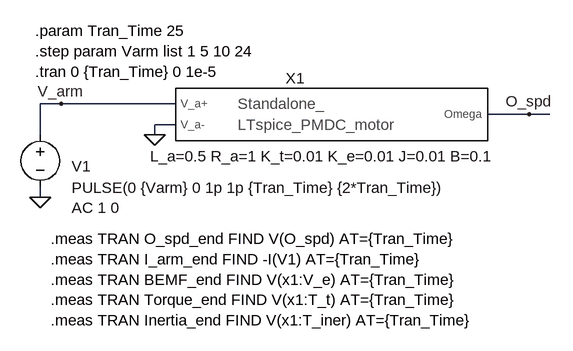
[diagram p0: schematic Jig_Standalone_LTspice_PMDC_motor.asc]
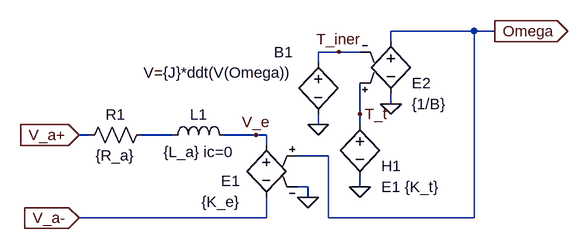
[diagram p1: sub-circuit standalone_ltspice_pmdc_motor.asc]
Jig_Standalone_LTspice_PMDC_motor.asc, the LTspice schematic file:
Version 4.1
SHEET 1 908 680
WIRE -64 64 -96 64
WIRE 112 64 -64 64
WIRE 656 80 592 80
WIRE 688 80 656 80
WIRE 112 96 80 96
WIRE -96 112 -96 64
WIRE 80 112 80 96
WIRE -96 208 -96 192
FLAG -96 208 0
FLAG 80 112 0
FLAG 656 80 O_spd
FLAG -64 64 V_arm
SYMBOL voltage -96 96 R0
WINDOW 0 48 64 Left 2
WINDOW 3 48 97 Left 2
WINDOW 123 48 128 Left 2
WINDOW 39 0 0 Left 0
SYMATTR InstName V1
SYMATTR Value PULSE(0 {Varm} 0 1p 1p {Tran_Time} {2*Tran_Time})
SYMATTR Value2 AC 1 0
SYMBOL Standalone_LTspice_PMDC_motor 288 80 R0
WINDOW 39 52 80 Bottom 2
SYMATTR SpiceLine L_a=0.5 R_a=1 K_t=0.01 K_e=0.01 J=0.01 B=0.1
SYMATTR InstName X1
TEXT -104 -48 Left 2 !.param Tran_Time 25\n.step param Varm list 1 5 10 24\n.tran 0 {Tran_Time} 0 1e-5
TEXT -80 272 Left 2 !.meas TRAN O_spd_end FIND V(O_spd) AT={Tran_Time}\n.meas TRAN I_arm_end FIND -I(V1) AT={Tran_Time}\n.meas TRAN BEMF_end FIND V(x1:V_e) AT={Tran_Time}\n.meas TRAN Torque_end FIND V(x1:T_t) AT={Tran_Time}\n.meas TRAN Inertia_end FIND V(x1:T_iner) AT={Tran_Time}

standalone_ltspice_pmdc_motor.asc, the sub-circuit schematic file:
Version 4.1
SHEET 1 880 680
WIRE 336 32 208 32
WIRE 368 32 336 32
WIRE 208 48 208 32
WIRE 128 64 96 64
WIRE 160 64 128 64
WIRE 96 80 96 64
WIRE 208 144 208 128
WIRE 160 160 160 112
WIRE 96 176 96 160
WIRE 160 176 160 160
WIRE -256 192 -272 192
WIRE -128 192 -176 192
WIRE 0 192 -48 192
WIRE 16 192 0 192
WIRE 16 208 16 192
WIRE 112 224 64 224
WIRE 80 272 64 272
WIRE 160 272 160 256
WIRE 80 288 80 272
WIRE 16 320 16 288
WIRE 16 320 -272 320
WIRE 112 320 112 224
WIRE 336 320 336 32
WIRE 336 320 112 320
FLAG 96 176 0
FLAG 160 272 0
FLAG 368 32 Omega
IOPIN 368 32 Out
FLAG 80 288 0
FLAG 0 192 V_e
FLAG 160 160 T_t
FLAG 208 144 0
FLAG -272 192 V_a+
IOPIN -272 192 In
FLAG -272 320 V_a-
IOPIN -272 320 In
FLAG 128 64 T_iner
SYMBOL res -160 176 R90
WINDOW 0 0 56 VBottom 2
WINDOW 3 32 56 VTop 2
SYMATTR InstName R1
SYMATTR Value {R_a}
SYMBOL ind -144 208 R270
WINDOW 0 32 56 VTop 2
WINDOW 3 5 56 VBottom 2
SYMATTR InstName L1
SYMATTR Value {L_a} ic=0
SYMATTR SpiceLine Rser=0
SYMBOL e 16 192 M0
WINDOW 0 40 71 Left 2
WINDOW 3 40 103 Left 2
SYMATTR InstName E1
SYMATTR Value {K_e}
SYMBOL h 160 160 R0
WINDOW 0 33 80 Left 2
WINDOW 3 33 112 Left 2
SYMATTR InstName H1
SYMATTR Value E1 {K_t}
SYMBOL bv 96 64 M0
WINDOW 0 39 0 Left 2
WINDOW 3 39 32 Left 2
SYMATTR InstName B1
SYMATTR Value V={J}*ddt(V(Omega))
SYMBOL e2 208 32 R0
WINDOW 0 32 80 Left 2
WINDOW 3 32 112 Left 2
SYMATTR InstName E2
SYMATTR Value {1/B}

The netlist it stands for:
* Jig_Standalone_LTspice_PMDC_motor.asc
V1 V_arm 0 PULSE(0 {Varm} 0 1p 1p {Tran_Time} {2*Tran_Time}) AC 1 0
X§X1 V_arm 0 O_spd standalone_ltspice_pmdc_motor params: L_a=0.5 R_a=1 K_t=0.01 K_e=0.01 J=0.01 B=0.1

* block symbol definitions
.subckt standalone_ltspice_pmdc_motor V_a+ V_a- Omega
R1 N001 V_a+ {R_a}
L1 N001 V_e {L_a} ic=0 Rser=0
E1 V_e V_a- Omega 0 {K_e}
H1 T_t 0 E1 {K_t}
B1 T_iner 0 V={J}*ddt(V(Omega))
E2 Omega 0 T_t T_iner {1/B}
.ends standalone_ltspice_pmdc_motor

.param Tran_Time 25
.step param Varm list 1 5 10 24
.tran 0 {Tran_Time} 0 1e-5
.meas TRAN O_spd_end FIND V(O_spd) AT={Tran_Time}
.meas TRAN I_arm_end FIND -I(V1) AT={Tran_Time}
.meas TRAN BEMF_end FIND V(x1:V_e) AT={Tran_Time}
.meas TRAN Torque_end FIND V(x1:T_t) AT={Tran_Time}
.meas TRAN Inertia_end FIND V(x1:T_iner) AT={Tran_Time}
.backanno
.end